# Altium schematic sheet LED.SchDoc
size A4; SheetNumber: 11; SheetTotal: 11
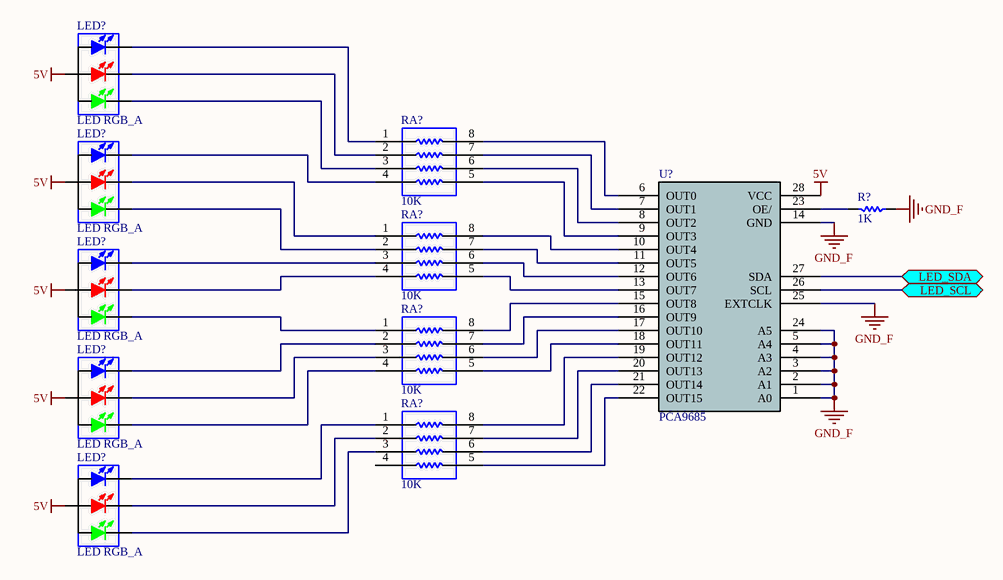
[diagram p0: LED.SchDoc]

## Parts
(Parts that share a designator on the sheet are numbered #1, #2 ... from top to bottom, then left to right.)
LED?#1  LED RGB_A  [RGB-020-A]
LED?#2  LED RGB_A  [RGB-020-A]
LED?#3  LED RGB_A  [RGB-020-A]
LED?#4  LED RGB_A  [RGB-020-A]
LED?#5  LED RGB_A  [RGB-020-A]
R?  1K  [R 0805]
RA?#1  10K  [RA1206 (4x0603)]
RA?#2  10K  [RA1206 (4x0603)]
RA?#3  10K  [RA1206 (4x0603)]
RA?#4  10K  [RA1206 (4x0603)]
U?  PCA9685  [TSSOP28]

## Ports
LED_SCL (bidir), LED_SDA (bidir)

## Nets
5V: LED?#1.3(RED_A) LED?#2.3(RED_A) LED?#3.3(RED_A) LED?#4.3(RED_A) LED?#5.3(RED_A) U?.28(VCC)
GND_F: R?.1 U?.1(A0) U?.2(A1) U?.3(A2) U?.4(A3) U?.5(A4) U?.14(GND) U?.24(A5) U?.25(EXTCLK)
LED_SCL: U?.26(SCL) ; port LED_SCL
LED_SDA: U?.27(SDA) ; port LED_SDA
NetLED?#1_1: LED?#1.1(BULE_K) RA?#1.1
NetLED?#1_2: LED?#1.2(GREEN_K) RA?#1.3
NetLED?#1_4: LED?#1.4(RED_K) RA?#1.2
NetLED?#2_1: LED?#2.1(BULE_K) RA?#1.4
NetLED?#2_2: LED?#2.2(GREEN_K) RA?#2.2
NetLED?#2_4: LED?#2.4(RED_K) RA?#2.1
NetLED?#3_1: LED?#3.1(BULE_K) RA?#2.3
NetLED?#3_2: LED?#3.2(GREEN_K) RA?#3.1
NetLED?#3_4: LED?#3.4(RED_K) RA?#2.4
NetLED?#4_1: LED?#4.1(BULE_K) RA?#3.2
NetLED?#4_2: LED?#4.2(GREEN_K) RA?#3.4
NetLED?#4_4: LED?#4.4(RED_K) RA?#3.3
NetLED?#5_1: LED?#5.1(BULE_K) RA?#4.1
NetLED?#5_2: LED?#5.2(GREEN_K) RA?#4.3
NetLED?#5_4: LED?#5.4(RED_K) RA?#4.2
NetR?_2: R?.2 U?.23(OE/)
NetRA?#1_5: RA?#1.5 U?.9(OUT3)
NetRA?#1_6: RA?#1.6 U?.8(OUT2)
NetRA?#1_7: RA?#1.7 U?.7(OUT1)
NetRA?#1_8: RA?#1.8 U?.6(OUT0)
NetRA?#2_5: RA?#2.5 U?.13(OUT7)
NetRA?#2_6: RA?#2.6 U?.12(OUT6)
NetRA?#2_7: RA?#2.7 U?.11(OUT5)
NetRA?#2_8: RA?#2.8 U?.10(OUT4)
NetRA?#3_5: RA?#3.5 U?.18(OUT11)
NetRA?#3_6: RA?#3.6 U?.17(OUT10)
NetRA?#3_7: RA?#3.7 U?.16(OUT9)
NetRA?#3_8: RA?#3.8 U?.15(OUT8)
NetRA?#4_5: RA?#4.5 U?.22(OUT15)
NetRA?#4_6: RA?#4.6 U?.21(OUT14)
NetRA?#4_7: RA?#4.7 U?.20(OUT13)
NetRA?#4_8: RA?#4.8 U?.19(OUT12)

Not connected (* = marked no-connect by the designer): RA?#4 4

## Library data of the parts
R? = R: Chip resistor; 版权归属: 源创客; BOM名称: Chip resistor; 学习资源: www.ooocke.com
RA?#1-RA?#4 = R-ARR: 4 way Chip Resistor Array
U? = PCA9685: 16-channel, 12-bit PWM Fm+ I2C-bus PWM LED controller , Servo Motor